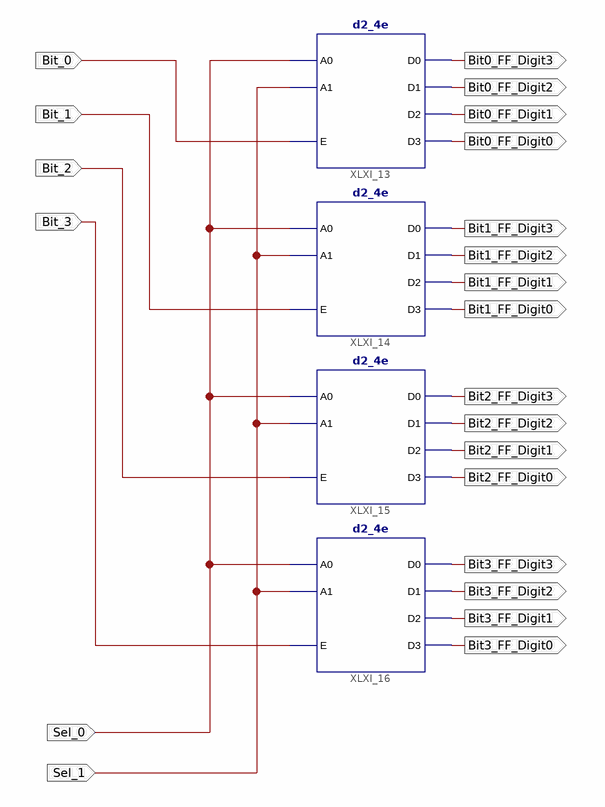
[diagram p0: schematic sheet 1]
// Xilinx ISE schematic Demux4_16.sch (spartan6) as structural Verilog: 4 symbols, 22 ports
module Demux4_16 (
  input  Bit_0,
  input  Bit_1,
  input  Bit_2,
  input  Bit_3,
  input  Sel_0,
  input  Sel_1,
  output Bit1_FF_Digit3,
  output Bit1_FF_Digit2,
  output Bit1_FF_Digit1,
  output Bit1_FF_Digit0,
  output Bit2_FF_Digit3,
  output Bit2_FF_Digit2,
  output Bit2_FF_Digit1,
  output Bit2_FF_Digit0,
  output Bit3_FF_Digit3,
  output Bit3_FF_Digit2,
  output Bit3_FF_Digit1,
  output Bit3_FF_Digit0,
  output Bit0_FF_Digit3,
  output Bit0_FF_Digit2,
  output Bit0_FF_Digit1,
  output Bit0_FF_Digit0
);

  d2_4e XLXI_14 (
    .A0(Sel_0), .A1(Sel_1), .E(Bit_1), .D0(Bit1_FF_Digit3), .D1(Bit1_FF_Digit2), .D2(Bit1_FF_Digit1),
    .D3(Bit1_FF_Digit0));
  d2_4e XLXI_15 (
    .A0(Sel_0), .A1(Sel_1), .E(Bit_2), .D0(Bit2_FF_Digit3), .D1(Bit2_FF_Digit2), .D2(Bit2_FF_Digit1),
    .D3(Bit2_FF_Digit0));
  d2_4e XLXI_16 (
    .A0(Sel_0), .A1(Sel_1), .E(Bit_3), .D0(Bit3_FF_Digit3), .D1(Bit3_FF_Digit2), .D2(Bit3_FF_Digit1),
    .D3(Bit3_FF_Digit0));
  d2_4e XLXI_13 (
    .A0(Sel_0), .A1(Sel_1), .E(Bit_0), .D0(Bit0_FF_Digit3), .D1(Bit0_FF_Digit2), .D2(Bit0_FF_Digit1),
    .D3(Bit0_FF_Digit0));
endmodule
